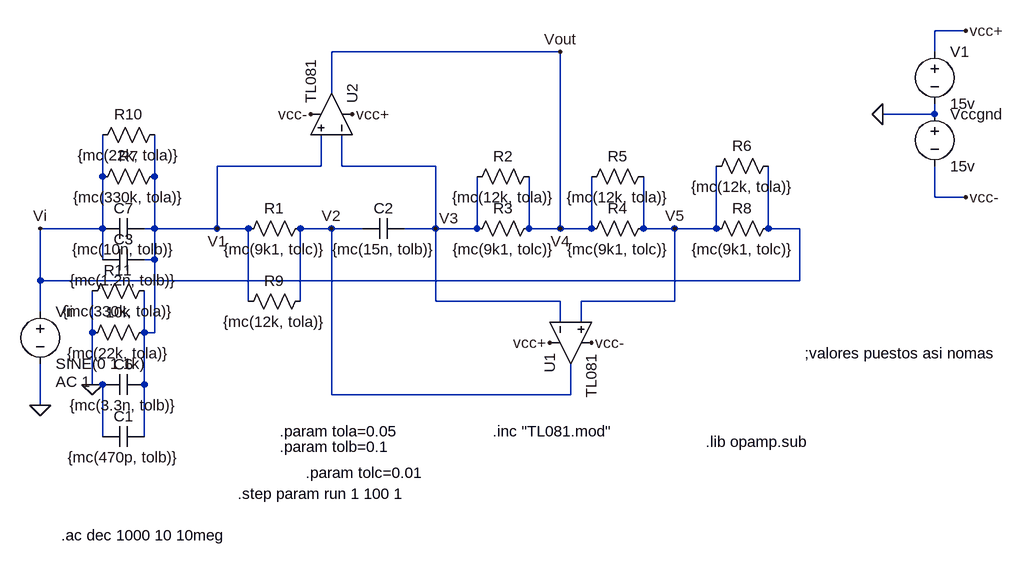
[diagram p0: schematic Simulacion_montecarlo.asc]
Simulacion_montecarlo.asc, the LTspice schematic file:
Version 4
SHEET 1 1384 680
WIRE 1280 -272 1232 -272
WIRE 656 -240 304 -240
WIRE 1232 -240 1232 -272
WIRE 304 -176 304 -240
WIRE 1232 -144 1232 -160
WIRE 1232 -144 1152 -144
WIRE 288 -64 288 -112
WIRE 288 -64 128 -64
WIRE 320 -64 320 -112
WIRE 464 -64 320 -64
WIRE -48 -48 -48 -112
WIRE 32 -48 32 -112
WIRE 1232 -16 1232 -64
WIRE 1280 -16 1232 -16
WIRE -48 32 -48 -48
WIRE -48 32 -144 32
WIRE 32 32 32 -48
WIRE 32 32 16 32
WIRE 128 32 128 -64
WIRE 128 32 32 32
WIRE 176 32 128 32
WIRE 304 32 256 32
WIRE 352 32 304 32
WIRE 464 32 464 -64
WIRE 464 32 416 32
WIRE 528 32 528 -48
WIRE 528 32 464 32
WIRE 608 32 608 -48
WIRE 656 32 656 -240
WIRE 656 32 608 32
WIRE 704 32 704 -48
WIRE 704 32 656 32
WIRE 784 32 784 -48
WIRE 832 32 784 32
WIRE 896 32 896 -64
WIRE 896 32 832 32
WIRE 976 32 976 -64
WIRE 1024 32 976 32
WIRE -48 80 -48 32
WIRE 32 80 32 32
WIRE 32 80 16 80
WIRE -144 112 -144 32
WIRE 1024 112 1024 32
WIRE 1024 112 -144 112
WIRE 176 144 176 32
WIRE 256 144 256 32
WIRE 464 144 464 32
WIRE 656 144 464 144
WIRE 832 144 832 32
WIRE 832 144 688 144
WIRE -144 160 -144 112
WIRE 656 176 656 144
WIRE 688 176 688 144
WIRE -64 192 -64 128
WIRE 16 192 16 128
WIRE 32 192 32 80
WIRE 32 192 16 192
WIRE -64 272 -64 192
WIRE -48 272 -64 272
WIRE 16 272 16 192
WIRE 304 288 304 32
WIRE 672 288 672 240
WIRE 672 288 304 288
WIRE -144 304 -144 240
WIRE -48 352 -48 272
WIRE 16 352 16 272
FLAG -144 304 0
FLAG -144 32 Vi
FLAG 128 32 V1
FLAG 304 32 V2
FLAG 464 32 V3
FLAG 656 32 V4
FLAG 832 32 V5
FLAG 1280 -272 vcc+
FLAG 1280 -16 vcc-
FLAG 1152 -144 0
FLAG -64 272 0
FLAG 640 208 vcc+
FLAG 336 -144 vcc+
FLAG 272 -144 vcc-
FLAG 704 208 vcc-
FLAG 656 -240 Vout
SYMBOL res 272 16 R90
WINDOW 0 0 56 VBottom 2
WINDOW 3 32 56 VTop 2
SYMATTR InstName R1
SYMATTR Value {mc(9k1, tolc)}
SYMBOL cap 416 16 R90
WINDOW 0 0 32 VBottom 2
WINDOW 3 32 32 VTop 2
SYMATTR InstName C2
SYMATTR Value {mc(15n, tolb)}
SYMBOL res 624 16 R90
WINDOW 0 0 56 VBottom 2
WINDOW 3 32 56 VTop 2
SYMATTR InstName R3
SYMATTR Value {mc(9k1, tolc)}
SYMBOL res 800 16 R90
WINDOW 0 0 56 VBottom 2
WINDOW 3 32 56 VTop 2
SYMATTR InstName R4
SYMATTR Value {mc(9k1, tolc)}
SYMBOL res 992 16 R90
WINDOW 0 0 56 VBottom 2
WINDOW 3 32 56 VTop 2
SYMATTR InstName R8
SYMATTR Value {mc(9k1, tolc)}
SYMBOL voltage -144 144 R0
WINDOW 123 24 124 Left 2
WINDOW 39 0 0 Left 0
SYMATTR Value2 AC 1
SYMATTR InstName Vii
SYMATTR Value SINE(0 1 1k)
SYMBOL cap 16 256 R90
WINDOW 0 0 32 VBottom 2
WINDOW 3 32 32 VTop 2
SYMATTR InstName C6
SYMATTR Value {mc(3.3n, tolb)}
SYMBOL res 32 176 R90
WINDOW 0 0 56 VBottom 2
WINDOW 3 32 56 VTop 2
SYMATTR InstName 10k
SYMATTR Value {mc(22k, tola)}
SYMBOL voltage 1232 -256 R0
SYMATTR InstName V1
SYMATTR Value 15v
SYMBOL voltage 1232 -160 R0
SYMATTR InstName Vccgnd
SYMATTR Value 15v
SYMBOL cap 16 16 R90
WINDOW 0 0 32 VBottom 2
WINDOW 3 32 32 VTop 2
SYMATTR InstName C7
SYMATTR Value {mc(10n, tolb)}
SYMBOL res 48 -64 R90
WINDOW 0 0 56 VBottom 2
WINDOW 3 32 56 VTop 2
SYMATTR InstName R7
SYMATTR Value {mc(330k, tola)}
SYMBOL Opamps\\opamp2 368 -144 M270
SYMATTR InstName U2
SYMATTR Value TL081
SYMBOL Opamps\\opamp2 608 208 M90
SYMATTR InstName U1
SYMATTR Value TL081
SYMBOL res 624 -64 R90
WINDOW 0 0 56 VBottom 2
WINDOW 3 32 56 VTop 2
SYMATTR InstName R2
SYMATTR Value {mc(12k, tola)}
SYMBOL res 800 -64 R90
WINDOW 0 0 56 VBottom 2
WINDOW 3 32 56 VTop 2
SYMATTR InstName R5
SYMATTR Value {mc(12k, tola)}
SYMBOL res 992 -80 R90
WINDOW 0 0 56 VBottom 2
WINDOW 3 32 56 VTop 2
SYMATTR InstName R6
SYMATTR Value {mc(12k, tola)}
SYMBOL res 272 128 R90
WINDOW 0 0 56 VBottom 2
WINDOW 3 32 56 VTop 2
SYMATTR InstName R9
SYMATTR Value {mc(12k, tola)}
SYMBOL res 48 -128 R90
WINDOW 0 0 56 VBottom 2
WINDOW 3 32 56 VTop 2
SYMATTR InstName R10
SYMATTR Value {mc(22k, tola)}
SYMBOL res 32 112 R90
WINDOW 0 0 56 VBottom 2
WINDOW 3 32 56 VTop 2
SYMATTR InstName R11
SYMATTR Value {mc(330k, tola)}
SYMBOL cap 16 336 R90
WINDOW 0 0 32 VBottom 2
WINDOW 3 32 32 VTop 2
SYMATTR InstName C1
SYMATTR Value {mc(470p, tolb)}
SYMBOL cap 16 64 R90
WINDOW 0 0 32 VBottom 2
WINDOW 3 32 32 VTop 2
SYMATTR InstName C3
SYMATTR Value {mc(1.2n, tolb)}
TEXT 552 344 Left 2 !.inc "TL081.mod"
TEXT 1032 224 Left 2 !;valores puestos asi nomas
TEXT 880 360 Left 2 !.lib opamp.sub
TEXT 224 344 Left 2 !.param tola=0.05
TEXT 224 368 Left 2 !.param tolb=0.1
TEXT 160 440 Left 2 !.step param run 1 100 1
TEXT -112 504 Left 2 !.ac dec 1000 10 10meg
TEXT 264 408 Left 2 !.param tolc=0.01

The netlist it stands for:
* Simulacion_montecarlo.asc
R1 V2 V1 {mc(9k1, tolc)}
C2 V3 V2 {mc(15n, tolb)}
R3 Vout V3 {mc(9k1, tolc)}
R4 V5 Vout {mc(9k1, tolc)}
R8 Vi V5 {mc(9k1, tolc)}
Vii Vi 0 SINE(0 1 1k) AC 1
C6 V1 0 {mc(3.3n, tolb)}
R§10k V1 0 {mc(22k, tola)}
V1 vcc+ 0 15v
Vccgnd 0 vcc- 15v
C7 V1 Vi {mc(10n, tolb)}
R7 V1 Vi {mc(330k, tola)}
XU2 V1 V3 vcc+ vcc- Vout TL081  ; pins In+ In- V+ V- OUT
XU1 V5 V3 vcc+ vcc- V2 TL081  ; pins In+ In- V+ V- OUT
R2 Vout V3 {mc(12k, tola)}
R5 V5 Vout {mc(12k, tola)}
R6 Vi V5 {mc(12k, tola)}
R9 V2 V1 {mc(12k, tola)}
R10 V1 Vi {mc(22k, tola)}
R11 V1 0 {mc(330k, tola)}
C1 V1 0 {mc(470p, tolb)}
C3 V1 Vi {mc(1.2n, tolb)}
.inc "TL081.mod"
;valores puestos asi nomas
.lib opamp.sub
.param tola=0.05
.param tolb=0.1
.step param run 1 100 1
.ac dec 1000 10 10meg
.param tolc=0.01
.backanno
.end